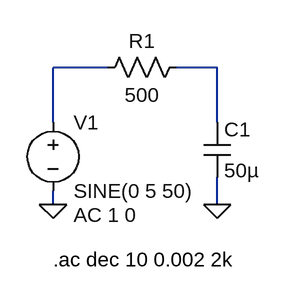
[diagram p0: schematic Low pass filter.asc]
Low pass filter.asc, the LTspice schematic file:
Version 4.1
SHEET 1 880 680
WIRE 176 80 112 80
WIRE 304 80 256 80
WIRE 112 144 112 80
WIRE 304 144 304 80
WIRE 112 240 112 224
WIRE 304 240 304 208
FLAG 112 240 0
FLAG 304 240 0
SYMBOL voltage 112 128 R0
WINDOW 123 24 124 Left 2
WINDOW 39 0 0 Left 0
SYMATTR InstName V1
SYMATTR Value SINE(0 5 50)
SYMATTR Value2 AC 1 0
SYMBOL res 272 64 R90
WINDOW 0 0 56 VBottom 2
WINDOW 3 32 56 VTop 2
SYMATTR InstName R1
SYMATTR Value 500
SYMBOL cap 288 144 R0
SYMATTR InstName C1
SYMATTR Value 50µ
TEXT 112 304 Left 2 !.ac dec 10 0.002 2k

The netlist it stands for:
* Low pass filter.asc
V1 N001 0 SINE(0 5 50) AC 1 0
R1 N002 N001 500
C1 N002 0 50µ
.ac dec 10 0.002 2k
.backanno
.end